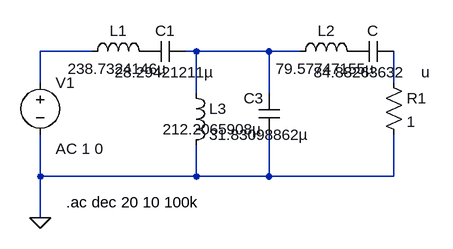
[diagram p0: schematic Draft3.asc]
Draft3.asc, the LTspice schematic file:
Version 4
SHEET 1 880 680
WIRE 16 240 -64 240
WIRE 176 240 160 240
WIRE 288 240 176 240
WIRE 336 240 288 240
WIRE -64 288 -64 240
WIRE 480 288 480 240
WIRE 176 304 176 240
WIRE 288 304 288 240
WIRE -64 432 -64 368
WIRE 176 432 176 384
WIRE 176 432 -64 432
WIRE 288 432 288 368
WIRE 288 432 176 432
WIRE 480 432 480 368
WIRE 480 432 288 432
WIRE -64 496 -64 432
FLAG -64 496 0
SYMBOL ind 0 256 R270
WINDOW 0 32 56 VTop 2
WINDOW 3 5 56 VBottom 2
SYMATTR InstName L1
SYMATTR Value 238.7324146µ
SYMBOL ind 320 256 R270
WINDOW 0 32 56 VTop 2
WINDOW 3 5 56 VBottom 2
SYMATTR InstName L2
SYMATTR Value 79.57747155µ
SYMBOL ind 160 288 R0
SYMATTR InstName L3
SYMATTR Value 31.83098862µ
SYMBOL cap 160 224 R90
WINDOW 0 0 32 VBottom 2
WINDOW 3 32 32 VTop 2
SYMATTR InstName C1
SYMATTR Value 28.29421211µ
SYMBOL cap 480 224 R90
WINDOW 0 0 32 VBottom 2
WINDOW 3 32 32 VTop 2
SYMATTR InstName C
SYMATTR Value 84.88263632	u
SYMBOL cap 304 368 R180
WINDOW 0 24 56 Left 2
WINDOW 3 24 8 Left 2
SYMATTR InstName C3
SYMATTR Value 212.2065908µ
SYMBOL voltage -64 272 R0
WINDOW 123 24 118 Left 2
SYMATTR InstName V1
SYMATTR Value ""
SYMATTR Value2 AC 1 0
SYMBOL res 464 272 R0
SYMATTR InstName R1
SYMATTR Value 1
TEXT -24 472 Left 2 !.ac dec 20 10 100k

The netlist it stands for:
* Draft3.asc
L1 N001 P001 238.7324146µ
L2 N002 P002 79.57747155µ
L3 N002 0 31.83098862µ
C1 N002 P001 28.29421211µ
C N003 P002 84.88263632	u
C3 0 N002 212.2065908µ
V1 N001 0 AC 1 0
R1 N003 0 1
.ac dec 20 10 100k
.backanno
.end